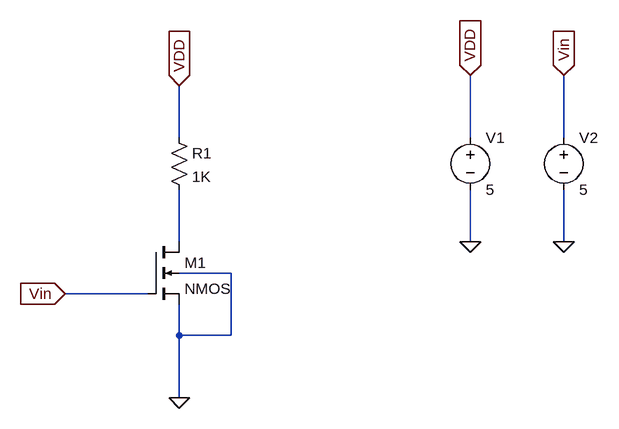
[diagram p0: schematic NMOSCharacteristics.asc]
NMOSCharacteristics.asc, the LTspice schematic file:
Version 4
SHEET 1 1056 680
WIRE 384 32 384 -48
WIRE 832 32 832 -64
WIRE 976 32 976 -64
WIRE 384 192 384 112
WIRE 832 192 832 112
WIRE 976 192 976 112
WIRE 464 240 384 240
WIRE 336 272 208 272
WIRE 384 336 384 288
WIRE 464 336 464 240
WIRE 464 336 384 336
WIRE 384 432 384 336
FLAG 384 -48 VDD
IOPIN 384 -48 In
FLAG 832 -64 VDD
IOPIN 832 -64 In
FLAG 832 192 0
FLAG 384 432 0
FLAG 976 192 0
FLAG 976 -64 Vin
IOPIN 976 -64 In
FLAG 208 272 Vin
IOPIN 208 272 In
SYMBOL nmos4 336 192 R0
SYMATTR InstName M1
SYMBOL res 368 16 R0
SYMATTR InstName R1
SYMATTR Value 1K
SYMBOL voltage 832 16 R0
WINDOW 123 0 0 Left 0
WINDOW 39 0 0 Left 0
SYMATTR InstName V1
SYMATTR Value 5
SYMBOL voltage 976 16 R0
WINDOW 123 0 0 Left 0
WINDOW 39 0 0 Left 0
SYMATTR InstName V2
SYMATTR Value 5

The netlist it stands for:
* NMOSCharacteristics.asc
M1 N001 Vin 0 0 NMOS
R1 VDD N001 1K
V1 VDD 0 5
V2 Vin 0 5
.model NMOS NMOS
.model PMOS PMOS
.lib standard.mos
.backanno
.end